# Altium project PDB_Custom_MCU.PrjPcb
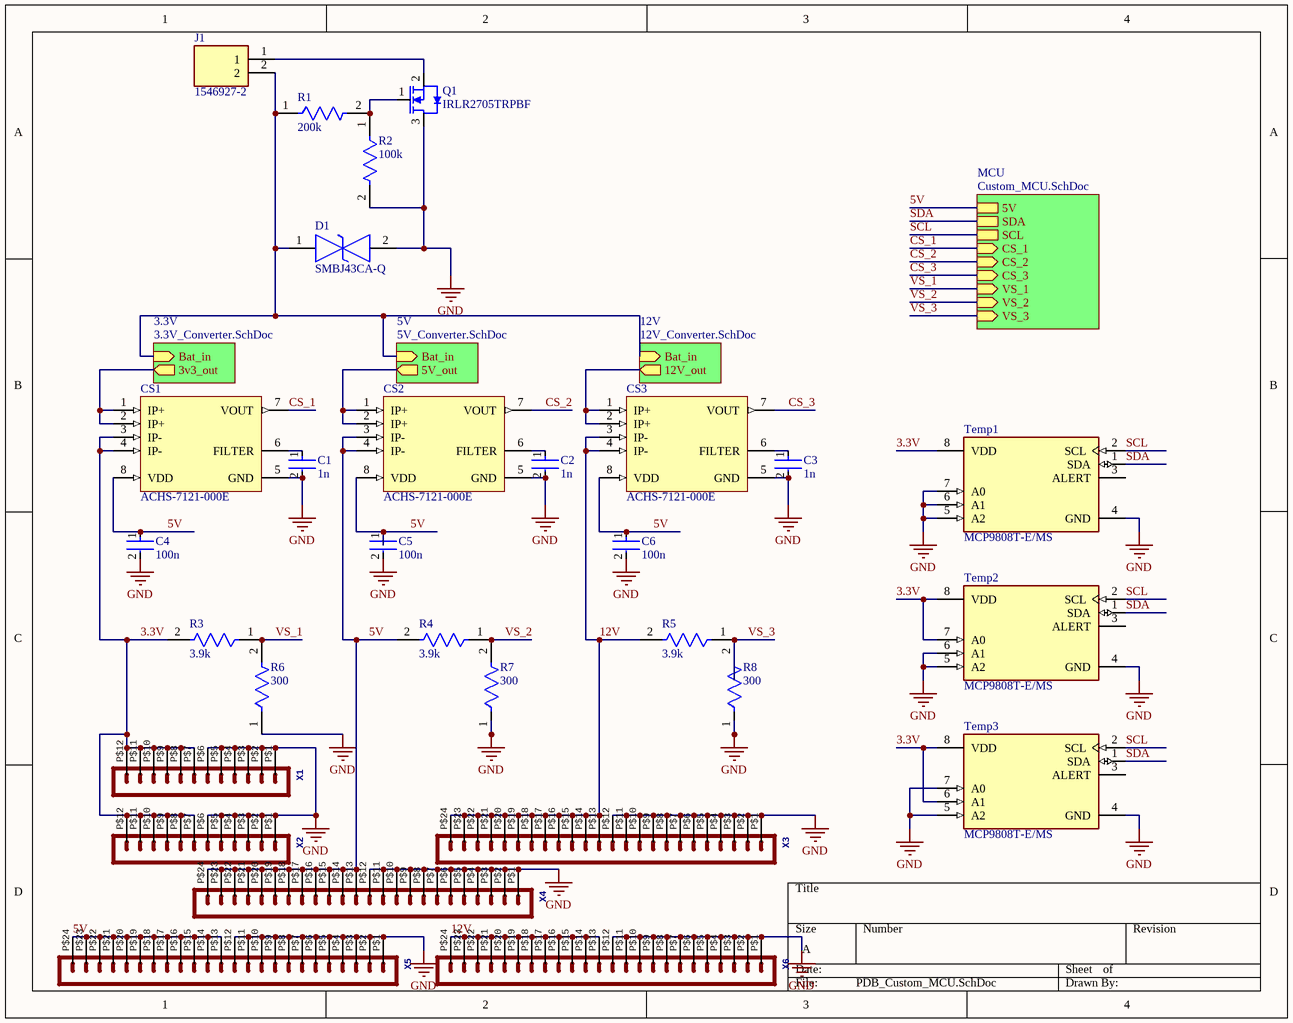
[diagram p0: PDB_Custom_MCU.SchDoc]
5 sheets, 83 parts. Net scope: hierarchical (ports join the sheet entries above them; power ports are global).
Board file: PDBMCU.PcbDoc
Sheets:
  PDB_Custom_MCU.SchDoc
    3.3V = 3.3V_Converter.SchDoc
    MCU = Custom_MCU.SchDoc
      Power = MCU_Power.SchDoc
      Connectors = MCU_Connectors.SchDoc

## Sheet PDB_Custom_MCU.SchDoc
size A; SheetNumber: 1; SheetTotal: 8

### Parts
C1  1n  [FP-0603-L_1_6_0_15-W_0_81-IPC_A]
C2  1n  [FP-0603-L_1_6_0_15-W_0_81-IPC_A]
C3  1n  [FP-0603-L_1_6_0_15-W_0_81-IPC_A]
C4  100n  [FP-CGA3E-0_3-0_1-IPC_A]
C5  100n  [FP-CGA3E-0_3-0_1-IPC_A]
C6  100n  [FP-CGA3E-0_3-0_1-IPC_A]
CS1  ACHS-7121-000E  [ACHS-7121-000E]
CS2  ACHS-7121-000E  [ACHS-7121-000E]
CS3  ACHS-7121-000E  [ACHS-7121-000E]
D1  SMBJ43CA-Q  [DIONM5436X244N]
J1  1546927-2  [SHDR2W119P0X826_1X2_1770X1549X1549P]
Q1  IRLR2705TRPBF  [IRLR2705TRPBF]
R1  200k  [FP-CRCW0603-e3-IPC_C]
R2  100k  [FP-RC0603-0_55-MFG]
R3  3.9k  [FP-CRCW0603-e3-IPC_A]
R4  3.9k  [FP-CRCW0603-e3-IPC_A]
R5  3.9k  [FP-CRCW0603-e3-IPC_A]
R6  300  [FP-CRCW0603-e3-IPC_A]
R7  300  [FP-CRCW0603-e3-IPC_A]
R8  300  [FP-CRCW0603-e3-IPC_A]
Temp1  MCP9808T-E/MS  [FP-C04-111-MFG]
Temp2  MCP9808T-E/MS  [FP-C04-111-MFG]
Temp3  MCP9808T-E/MS  [FP-C04-111-MFG]
X1  Molex - Micro-Fit 3.0 Series connector,  3.00mm (0.118") pitch header, 12 positions.  [44914-1201]  (value not drawn)
X2  Molex - Micro-Fit 3.0 Series connector,  3.00mm (0.118") pitch header, 12 positions.  [44914-1201]  (value not drawn)
X3  Molex - Micro-Fit 3.0 Series connector,  3.00mm (0.118") pitch header, 24 positions.  [44914-2401]  (value not drawn)
X4  Molex - Micro-Fit 3.0 Series connector,  3.00mm (0.118") pitch header, 24 positions.  [44914-2401]  (value not drawn)
X5  Molex - Micro-Fit 3.0 Series connector,  3.00mm (0.118") pitch header, 24 positions.  [44914-2401]  (value not drawn)
X6  Molex - Micro-Fit 3.0 Series connector,  3.00mm (0.118") pitch header, 24 positions.  [44914-2401]  (value not drawn)

### Sub-sheets
3.3V = 3.3V_Converter.SchDoc: 3v3_out (out), Bat_in (in)
5V = 5V_Converter.SchDoc (file not in this document): Bat_in (in), 5V_out (out)
12V = 12V_Converter.SchDoc (file not in this document): 12V_out (out), Bat_in (in)
MCU = Custom_MCU.SchDoc: CS_2 (in), CS_3 (in), CS_1 (in), 5V, VS_3 (in), VS_2 (in), VS_1 (in), SDA, SCL

### Nets
GND: C1.2 C2.2 C3.2 C4.2 C5.2 C6.2 CS1.5(GND) CS2.5(GND) CS3.5(GND) D1.2 Q1.3 R2.2 R6.1 R7.1 R8.1 Temp1.4(GND) Temp1.5(A2) Temp1.6(A1) Temp1.7(A0) Temp2.4(GND) Temp2.5(A2) Temp2.6(A1) Temp3.4(GND) Temp3.5(A2) Temp3.7(A0) X1.P$1 X1.P$2 X1.P$3 X1.P$4 X1.P$5 X1.P$6 X2.P$1 X2.P$2 X2.P$3 X2.P$4 X2.P$5 X2.P$6 X3.P$1 X3.P$2 X3.P$3 X3.P$4 X3.P$5 X3.P$6 X3.P$7 X3.P$8 X3.P$9 X3.P$10 X3.P$11 X3.P$12 X4.P$1 X4.P$2 X4.P$3 X4.P$4 X4.P$5 X4.P$6 X4.P$7 X4.P$8 X4.P$9 X4.P$10 X4.P$11 X4.P$12 X5.P$1 X5.P$2 X5.P$3 X5.P$4 X5.P$5 X5.P$6 X5.P$7 X5.P$8 X5.P$9 X5.P$10 X5.P$11 X5.P$12 X6.P$1 X6.P$2 X6.P$3 X6.P$4 X6.P$5 X6.P$6 X6.P$7 X6.P$8 X6.P$9 X6.P$10 X6.P$11 X6.P$12
3.3V: CS1.3(IP-) CS1.4(IP-) R3.2 Temp1.8(VDD) Temp2.7(A0) Temp2.8(VDD) Temp3.6(A1) Temp3.8(VDD) X1.P$7 X1.P$8 X1.P$9 X1.P$10 X1.P$11 X1.P$12 X2.P$7 X2.P$8 X2.P$9 X2.P$10 X2.P$11 X2.P$12
5V: C4.1 C5.1 C6.1 CS1.8(VDD) CS2.3(IP-) CS2.4(IP-) CS2.8(VDD) CS3.8(VDD) R4.2 X4.P$13 X4.P$14 X4.P$15 X4.P$16 X4.P$17 X4.P$18 X4.P$19 X4.P$20 X4.P$21 X4.P$22 X4.P$23 X4.P$24 X5.P$13 X5.P$14 X5.P$15 X5.P$16 X5.P$17 X5.P$18 X5.P$19 X5.P$20 X5.P$21 X5.P$22 X5.P$23 X5.P$24 ; sheet MCU/5V
12V: CS3.3(IP-) CS3.4(IP-) R5.2 X3.P$13 X3.P$14 X3.P$15 X3.P$16 X3.P$17 X3.P$18 X3.P$19 X3.P$20 X3.P$21 X3.P$22 X3.P$23 X3.P$24 X6.P$13 X6.P$14 X6.P$15 X6.P$16 X6.P$17 X6.P$18 X6.P$19 X6.P$20 X6.P$21 X6.P$22 X6.P$23 X6.P$24
CS_1: CS1.7(VOUT) ; sheet MCU/CS_1
CS_2: CS2.7(VOUT) ; sheet MCU/CS_2
CS_3: CS3.7(VOUT) ; sheet MCU/CS_3
SCL: Temp1.2(SCL) Temp2.2(SCL) Temp3.2(SCL) ; sheet MCU/SCL
SDA: Temp1.1(SDA) Temp2.1(SDA) Temp3.1(SDA) ; sheet MCU/SDA
VS_1: R3.1 R6.2 ; sheet MCU/VS_1
VS_2: R4.1 R7.2 ; sheet MCU/VS_2
VS_3: R5.1 R8.2 ; sheet MCU/VS_3
NetC1_1: C1.1 CS1.6(FILTER)
NetC2_1: C2.1 CS2.6(FILTER)
NetC3_1: C3.1 CS3.6(FILTER)
NetCS1_1: CS1.1(IP+) CS1.2(IP+) ; sheet 3.3V/3v3_out
NetCS2_1: CS2.1(IP+) CS2.2(IP+) ; sheet 5V/5V_out
NetCS3_1: CS3.1(IP+) CS3.2(IP+) ; sheet 12V/12V_out
NetD1_1: D1.1 J1.2 R1.1 ; sheet 3.3V/Bat_in, sheet 5V/Bat_in, sheet 12V/Bat_in
NetJ1_1: J1.1 Q1.2
NetQ1_1: Q1.1 R1.2 R2.1

Not connected (* = marked no-connect by the designer): Temp1 3(ALERT); Temp2 3(ALERT); Temp3 3(ALERT)

### Library data of the parts
C1-C3 = CMP-2006-04378-2: General Purpose Ceramic Capacitor, 0603, 1nF, 10%, X7R, 15%, 50V; Case Code (Metric): 1608; Min Operating Temperature: -55°C; Weight: 7.1E-05oz; Series: -; Capacitance: 1nF; RoHS Compliant: Yes; Radiation Hardening: No; Height: 0.9mm; Mount: Surface Mount; REACH SVHC: No SVHC; Lead Free: Lead Free; Depth: 0.81mm; Voltage: 50V; Number of Pins: 2; Voltage Rating: 50V; Max Operating Temperature: 125°C; Termination: SMD/SMT; Construction: Flat; Case Code (Imperial): 0603; Dielectric: X7R; Width: 0.032inch; Tolerance: 10%; Case/Package: 0603; Contact Plating: Tin; Packaging: Tape and Reel; Voltage Rating (DC): 50V; Dielectric Material: Ceramic; Package Quantity: 4000; Thickness: 0.035inch; Length: 1.6mm
C4-C6 = CMP-2000-07546-2: Cap Ceramic 100nF 50V X7R 10% Pad SMD 0603 +125°C Automotive T/R; Weight: 7.1E-05oz; Composition: Ceramic; Max Operating Temperature: 125°C; Termination: SMD/SMT; Dielectric: X7R; Length: 1.6mm; Package Quantity: 1; REACH SVHC: No SVHC; Lead Free: Lead Free; Case Code (Metric): 1608; Min Operating Temperature: -55°C; Packaging: Tape and Reel; Tolerance: 10%; Voltage Rating: 50V; Case Code (Imperial): 0603; Capacitance: 100nF; Case/Package: 0603; Voltage Rating (DC): 50V; Depth: 0.8mm; Radiation Hardening: No; Ratings: AEC-Q200; Mount: Surface Mount; Voltage: 50V; Thickness: 0.035inch; Width: 0.8mm; Height: 0.8mm
D1 = SMBJ43CA-Q: TVS Diode (Bi-directional); Manufacturer_Name: Bourns; Assembled: yes; Datasheet Link: https://www.bourns.com/docs/Product-Datasheets/SMBJ-Q.pdf; Height: 2.44mm; Manufacturer_Part_Number: SMBJ43CA-Q; Mouser Part Number: 652-SMBJ43CA-Q; Mouser Price/Stock: https://www.mouser.co.uk/ProductDetail/Bourns/SMBJ43CA-Q?qs=f9yNj16SXrKKVbIQ83PDKg%3D%3D; Arrow Part Number: SMBJ43CA-Q; Arrow Price/Stock: https://www.arrow.com/en/products/smbj43ca-q/bourns?region=nac; Distributor: JLCPCB; JLCPCB Part Number: C224021
J1 = 1546927-2: Connector; Manufacturer_Name: TE Connectivity; Datasheet Link: https://www.te.com/commerce/DocumentDelivery/DDEController?Action=showdoc&DocId=Customer+Drawing%7F1546927%7FA3%7Fpdf%7FEnglish%7FENG_CD_1546927_A3.pdf%7F1546927-2; Height: 15.494mm; Manufacturer_Part_Number: 1546927-2; Mouser Part Number: 571-1546927-2; Mouser Price/Stock: https://www.mouser.co.uk/ProductDetail/TE-Connectivity/1546927-2?qs=30v%252BXxGwGAoQPG4oeAAMCA%3D%3D; Arrow Part Number: 1546927-2; Arrow Price/Stock: https://www.arrow.com/en/products/1546927-2/te-connectivity
R1 = CMP-2000-03059-2: RES Thick Film, 200kΩ, 1%, 0.1W, 100ppm/°C, 0603; Resistance: 200kR; Voltage Rating (DC): 75V; Power Rating: 100mW; Termination: SMD/SMT; Depth: 0.85mm; Military Standard: Not; Case Code (Metric): 1608; Composition: Thick Film; Package Quantity: 10; Width: 0.033inch; Voltage Rating: 75V; Features: Automotive AEC-Q200; Max Power Dissipation: 100mW; Height: 0.45mm; Mount: Surface Mount; Max Operating Temperature: 155°C; Weight: 7.1E-05oz; Lead Free: Lead Free; Length: 1.55mm; Radiation Hardening: No; Case/Package: 0603; Packaging: Tape and Reel; Contact Plating: Tin; Min Operating Temperature: -55°C; Working Voltage: 75V; Temperature Coefficient: 100ppm/°C; Case Code (Imperial): 0603; Tolerance: 1%; Number of Terminations: 2
R2 = CMP-2100-03662-2: RES SMD 100K OHM 1% 1/10W 0603; Voltage Rating (DC): 50V; Resistance: 100kR; Max Power Dissipation: 100mW; Temperature Coefficient: 100ppm/°C; Working Voltage: 75V; Length: 1.6mm; Lead Free: Lead Free; Number of Terminations: 2; Packaging: Tape and Reel; Voltage Rating: 50V; Termination: SMD/SMT; Width: 0.8mm; Resistor Type: Thick Film; Resistance Tolerance: 1%; Features: Moisture Resistant; Height: 0.45mm; Construction: Rectangular; Case/Package: 0603; Military Standard: Not; Case Code (Imperial): 0603; Series: RC; Technology: THICK FILM; Depth: 0.8mm; RoHS Compliant: Yes; REACH SVHC: No SVHC; Min Operating Temperature: -55°C; Case Code (Metric): 1608; Max Operating Temperature: 155°C; Power Rating: 100mW; Number of Pins: 2; Tolerance: 1%
R3-R5 = CMP-02407-001779-1: RES Thick Film, 3.9kΩ, 1%, 0.1W, 100ppm/°C, 0603; Voltage Rating: 75V; Power Rating: 100mW; Resistance: 3.9kR; Case Code (Imperial): 0603; Military Standard: Not; Length: 1.55mm; Lead Free: Lead Free; Max Operating Temperature: 155°C; Working Voltage: 75V; Termination: SMD/SMT; Min Operating Temperature: -55°C; Contact Plating: Tin; Depth: 0.85mm; Packaging: Tape and Reel; Voltage Rating (DC): 75V; Tolerance: 1%; Features: Automotive AEC-Q200; Package Quantity: 10; Composition: Thick Film; Mount: Surface Mount; Width: 0.033inch; Radiation Hardening: No; Max Power Dissipation: 100mW; Height: 0.45mm; Temperature Coefficient: 100ppm/°C; Weight: 7.1E-05oz; Case Code (Metric): 1608; Case/Package: 0603; Number of Terminations: 2
R6-R8 = CMP-2000-03216-2: RES Thick Film, 300Ω, 1%, 0.1W, 100ppm/°C, 0603; Voltage Rating (DC): 75V; Power Rating: 100mW; Resistance: 300R; Length: 1.55mm; Height: 0.45mm; Case/Package: 0603; Temperature Coefficient: 100ppm/°C; Packaging: Tape and Reel; Termination: SMD/SMT; Depth: 0.85mm; Max Operating Temperature: 155°C; Radiation Hardening: No; Tolerance: 1%; Lead Free: Lead Free; Case Code (Metric): 1608; Voltage Rating: 75V; Weight: 7.1E-05oz; Package Quantity: 10; Military Standard: Not; Case Code (Imperial): 0603; Composition: Thick Film; Min Operating Temperature: -55°C; Width: 0.033inch; Number of Terminations: 2; Mount: Surface Mount; Features: Automotive AEC-Q200; Contact Plating: Tin; Max Power Dissipation: 100mW
Temp1-Temp3 = CMP-0192-00343-2: SENSOR DIGITAL -40C-125C 8MSOP; Interface: I2C; Operating Supply Current: 200uA; Resolution: 10b; Min Supply Voltage: 2.7V; Max Supply Voltage (DC): 5.5V; Width: 3mm; Height: 0.95mm; Package Quantity: 2500; Length: 3mm; Lead Free: Lead Free; Radiation Hardening: No; Number of Pins: 8; Min Supply Voltage (DC): 2.7V; Output Type: Digital; Packaging: Tape and Reel; Max Supply Voltage: 5.5V; Max Operating Temperature: 125°C; Case/Package: MSOP; Min Operating Temperature: -40°C
X1 X2 = HEADER_POS12_?44914-1201: GateName_1: G$1; SymbolName_1: HEADER_POS12; DeviceName: 44914-1201; LibraryName: con-molex-micro-fit-3_0_2; DeviceSetName: HEADER_POS12_?; Package: 44914-1201
X3-X6 = HEADER_POS24_?44914-2401: GateName_1: G$1; SymbolName_1: HEADER_POS24; DeviceName: 44914-2401; LibraryName: con-molex-micro-fit-3_0_2; DeviceSetName: HEADER_POS24_?; Package: 44914-2401

## Sheet 3.3V_Converter.SchDoc
size A; SheetNumber: 2; SheetTotal: 8
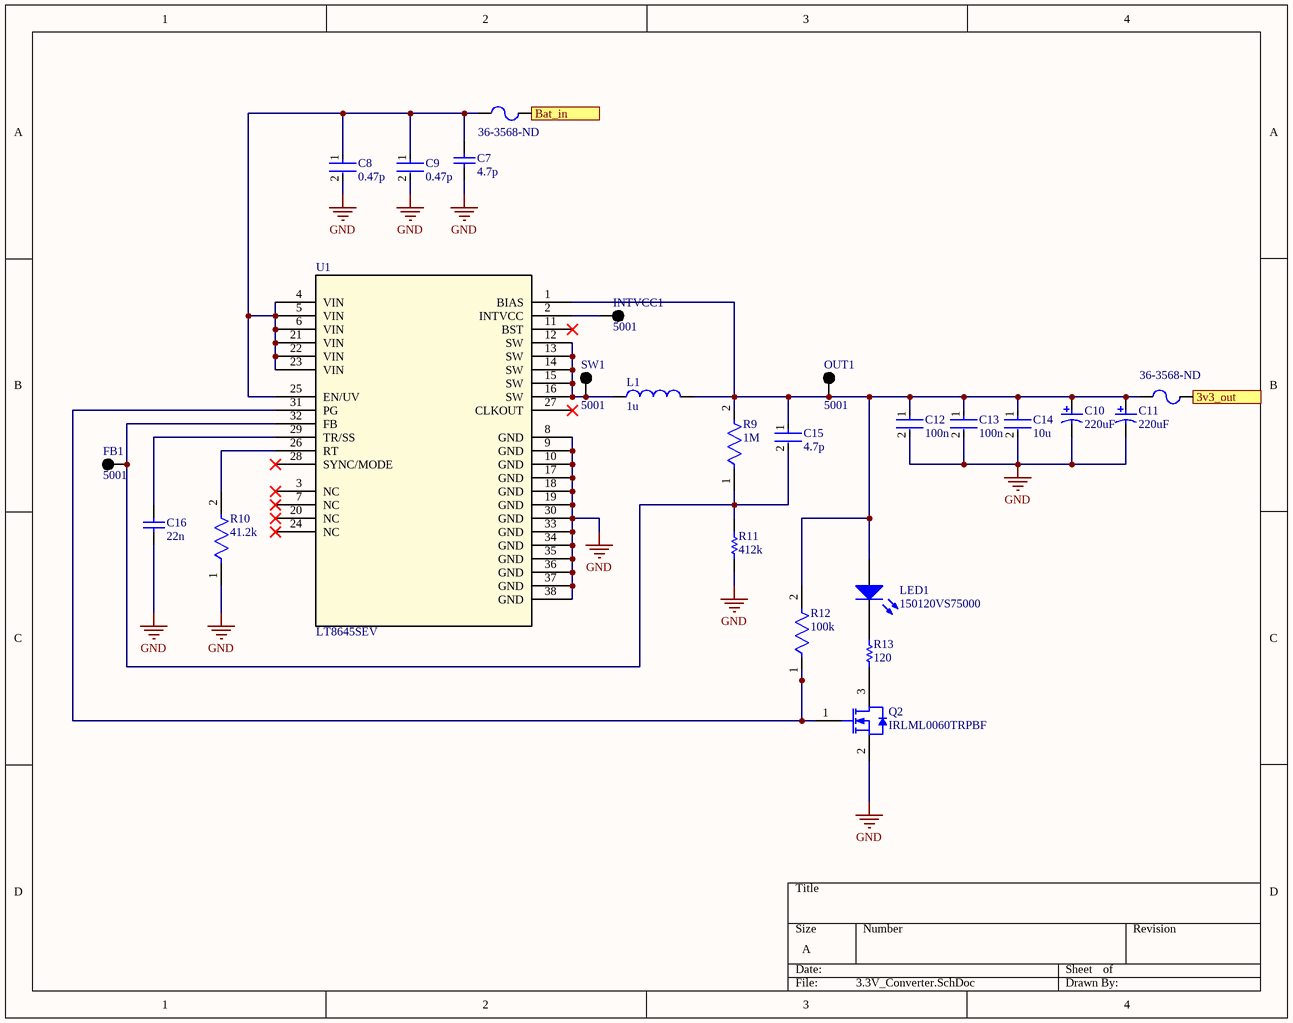
[diagram p1: 3.3V_Converter.SchDoc]

### Parts
C7  4.7p  [CAPC1608X90X35ML10T15]
C8  0.47p  [FP-CL21-IPC_B]
C9  0.47p  [FP-CL21-IPC_B]
C10  220uF  [CAPPR65-500-1250X1000X1350]
C11  220uF  [CAPPR65-500-1250X1000X1350]
C12  100n  [FP-CL10-IPC_A]
C13  100n  [FP-CL10-IPC_A]
C14  10u  [FP-GRM21B-0_15-IPC_C]
C15  4.7p  [FP-0603-L_1_6_0_15-W_0_81-MFG]
C16  22n  [CAPC1608X90X35ML10T15]
F1  36-3568-ND  [PCBComponent_1]
F2  36-3568-ND  [PCBComponent_1]
FB1  5001  [KSTN-5001]
INTVCC1  5001  [KSTN-5001]
L1  1u  [PCBComponent_1]
LED1  150120VS75000  [1206_A]
OUT1  5001  [KSTN-5001]
Q2  IRLML0060TRPBF  [INTR-SOT-23-3_V]
R9  1M  [FP-CRCW0603-e3-MFG]
R10  41.2k  [FP-CRCW0603-e3-MFG]
R11  412k  [RESC1608X55X30LL15T15]
R12  100k  [FP-RC0603-0_55-MFG]
R13  120  [RESC1609X55X30ML15T15]
SW1  5001  [KSTN-5001]
U1  LT8645SEV  [LQFN-32]

### Ports
3v3_out (out), Bat_in (in)

### Nets
GND: C7.1 C8.2 C9.2 C10.2 C11.2 C12.2 C13.2 C14.2 C16.1 Q2.2(S) R10.1 R11.1 U1.8(GND) U1.9(GND) U1.10(GND) U1.17(GND) U1.18(GND) U1.19(GND) U1.30(GND) U1.33(GND) U1.34(GND) U1.35(GND) U1.36(GND) U1.37(GND) U1.38(GND)
NetC7_2: C7.2 C8.1 C9.1 F1.1 U1.4(VIN) U1.5(VIN) U1.6(VIN) U1.21(VIN) U1.22(VIN) U1.23(VIN) U1.25(EN/UV)
NetC10_1: C10.1 C11.1 C12.1 C13.1 C14.1 C15.1 F2.1 L1.2 LED1.2(A) OUT1.1 R9.2 R12.2 U1.1(BIAS)
NetC15_2: C15.2 FB1.1 R9.1 R11.2 U1.32(FB)
NetC16_2: C16.2 U1.29(TR/SS)
NetCS1_1: F2.2 ; port 3v3_out
NetD1_1: F1.2 ; port Bat_in
NetINTVCC1_1: INTVCC1.1 U1.2(INTVCC)
NetL1_1: L1.1 SW1.1 U1.12(SW) U1.13(SW) U1.14(SW) U1.15(SW) U1.16(SW)
NetLED1_1: LED1.1(K) R13.2
NetQ2_1: Q2.1(G) R12.1 U1.31(PG)
NetQ2_3: Q2.3(D) R13.1
NetR10_2: R10.2 U1.26(RT)

Not connected (* = marked no-connect by the designer): U1 3(NC)* 7(NC)* 11(BST)* 20(NC)* 24(NC)* 27(CLKOUT)* 28(SYNC/MODE)*

### Library data of the parts
C7 = CMP-2006-02676-1: Part Number: GRM1885C1H4R7CA01D; Manufacturer: Murata
C8 C9 = CMP-13271-000950-1: CL21 Series 0805 0.47pF 50V ±0.1pF Tolerance C0G Multilayer Ceramic Chip Capacitor; Temperature Coefficient: 300ppm/°C; Length: 2mm; Case Code (Metric): 2012; Width: 0.049inch; Case Code (Imperial): 0805; Radiation Hardening: No; Voltage: 50V; Height: 0.65mm; Voltage Rating (DC): 50V; Package Quantity: 1; Capacitance: 0.47pF; Voltage Rating: 50V; Max Operating Temperature: 125°C; Min Operating Temperature: -55°C; Dielectric: C0G; Depth: 1.25mm; Thickness: 0.03inch; Lead Free: Lead Free; Packaging: Tape and Reel; Case/Package: 0805; Mount: Surface Mount
C10 C11 = CMP-1665-00043-1: Aluminum Electrolytic Capacitor, 220 uF, +/- 20%, 50 V, -40 to 85 degC, 2-Pin THD, RoHS, Bulk; Max Supply Voltage: 5.5 V; Min Supply Voltage: 4.5 V; Propagation Delay: 10 us; Data Rate: 120 kbps; Nominal Supply Current: 10 mA; Case\Package: SOIC; Nominal Supply Voltage: 5 V; Channels: 2; Interface: RS-232; Width: 4 mm; Packaging: Rail/Tube; ComponentLink2Description: Datasheet; Height: 1.5 mm; PackageReference: CAPPR65-500-1250X1000X1350; Pins: 16; DatasheetVersion: Mar-16; Max Operating Temperature: 70 degC; Length: 10 mm; REACH SVHC: No SVHC; ComponentLink1Description: Manufacturer URL; Package Quantity: 50; ComponentLink2URL: http://industrial.panasonic.com/cdbs/www-data/pdf/RDF0000/DMF0000COL68.pdf; ComponentLink1URL: http://www.panasonic.com/; PackageDescription: 2-Pin Radial Lead, Dia 10 mm, Body Length 12.5 mm; Min Operating Temperature: 0 degC; Radiation Hardening: No; RoHSCompliant: true; Mount: Surface Mount
C12 C13 = CMP-13271-000587-1: Cap Ceramic 100nF 50V X7R ±10% Pad SMD 0603 +125°C T/R; Case/Package: 0603; Depth: 0.8mm; Max Operating Temperature: 125°C; Lead Free: Lead Free; Material: Ceramic; Voltage Rating: 50V; Min Operating Temperature: -55°C; Voltage Rating (DC): 50V; Dielectric: X7R; Height: 0.8mm; Capacitance: 100nF; Thickness: 0.035inch; Radiation Hardening: No; Voltage: 50V; Packaging: Tape and Reel; Length: 1.6mm; Tolerance: 10%; Width: 0.031inch; Mount: Surface Mount; Package Quantity: 10000
C14 = CMP-2007-03541-2: Chip Multilayer Ceramic Capacitors for General Purpose, 0805, 10uF, X5R, 15%, 10%, 25V; Length: 2mm; Depth: 1.25mm; Termination: SMD/SMT; Voltage: 25V; Height: 1.25mm; Material: Ceramic; Thickness: 0.053inch; Radiation Hardening: No; Min Operating Temperature: -55°C; Width: 0.049inch; Package Quantity: 1; Mount: Surface Mount; Dielectric: X5R; Packaging: Tape and Reel; Capacitance: 10uF; Voltage Rating (DC): 25V; Lead Free: Lead Free; Max Operating Temperature: 85°C; Case Code (Imperial): 0805; Case/Package: 0805; Tolerance: 10%; Voltage Rating: 25V; Case Code (Metric): 2012
C15 = CMP-2006-04327-2: General Purpose Ceramic Capacitor, 0603, 4.7pF, 0.25pF, NP0, 30ppm/°C, 50V; Insulation Resistance: 100GR; Dielectric: C0G; Case/Package: 0603; RoHS Compliant: Yes; Case Code (Imperial): 0603; Contact Plating: Tin; REACH SVHC: No SVHC; Construction: Flat; Voltage Rating: 50V; Case Code (Metric): 1608; Min Operating Temperature: -55°C; Termination: SMD/SMT; Max Operating Temperature: 125°C; Capacitance: 4.7pF; Depth: 0.81mm; Radiation Hardening: No; Lead Free: Lead Free; Mount: Surface Mount; Thickness: 0.035inch; Width: 0.81mm; Series: -; Package Quantity: 4000; Packaging: Tape and Reel; Number of Pins: 2; Temperature Coefficient: 30ppm/°C; Voltage Rating (DC): 50V; Height: 0.86mm; Length: 1.6mm
C16 = CMP-2006-02910-1: Manufacturer: Murata; Part Number: GRM188R71H223KA01D
F1 F2 = Fuse_Holder
FB1 = CMP-2000-05181-1: Test Point, Black, 1-Pin THD, RoHS, Bulk; Manufacturer: Keystone; Other Names: 5001K; Catalog Drawings: 5000Series; Alternate Color: 5004K-ND / -TESTPOINTPCMINI.040"DYELLOW / 5003K-ND / -TESTPOINTPCMINI.040"DORANGE / 5002K-ND / -TESTPOINTPCMINI.040"DWHITE / 5000K-ND / -TESTPOINTPCMINI.040"DRED; Kits: DKTGRS232C-KIT-ND / -TTLCONVERTER; Material: Base,Nylon46,UL94V-0; Type: PCTestPoint,Miniature; Online Catalog: ColorCodedTestPoints; Datasheet URL: https://ciiva.com/datasheet-click-2917627?src=ciiva&sig=bd195616; Mounting Type: 0.040"(1.02mm)HoleDiameter; Family: TestPoints; RoHS Information: RoHSComplianceStatement; Datasheet Version: Rev. G, 12/2008; Color: Black; Category: TestandMeasurement; Standard Package: 100; Manufacturer URL: http://www.keyelco.com/; Terminal: 0.010"x0.020"(0.25mmx0.51mm)PhosphorBronzeWire,SilverPlated; Series: THM; Packaging: Bulk
INTVCC1 OUT1 SW1 = CMP-2000-05181-1: Test Point, Black, 1-Pin THD, RoHS, Bulk; Manufacturer: Keystone; Other Names: 5001K; Catalog Drawings: 5000Series; Alternate Color: 5004K-ND / -TESTPOINTPCMINI.040"DYELLOW / 5003K-ND / -TESTPOINTPCMINI.040"DORANGE / 5002K-ND / -TESTPOINTPCMINI.040"DWHITE / 5000K-ND / -TESTPOINTPCMINI.040"DRED; Kits: DKTGRS232C-KIT-ND / -TTLCONVERTER; Online Catalog: ColorCodedTestPoints; Datasheet URL: https://ciiva.com/datasheet-click-2917627?src=ciiva&sig=bd195616; Mounting Type: 0.040"(1.02mm)HoleDiameter; Family: TestPoints; RoHS Information: RoHSComplianceStatement; Datasheet Version: Rev. G, 12/2008; Color: Black; Category: TestandMeasurement; Standard Package: 100; Manufacturer URL: http://www.keyelco.com/; Material: Base,Nylon46,UL94V-0; Type: PCTestPoint,Miniature; Terminal: 0.010"x0.020"(0.25mmx0.51mm)PhosphorBronzeWire,SilverPlated; Series: THM; Packaging: Bulk
L1 = XAL6030-102MEC
LED1 = CMP-1426-00016-1: SMD mono-color Chip LED, WL-SMCW, Bright Green; Manufacturer: Wuerth Elektronik; ComponentLink2URL: http://katalog.we-online.com/led/datasheet/150120VS75000.pdf; PartNumber: 150120VS75000; Color: Bright Green; ComponentLink2Description: Datasheet; ComponentLink1URL: http://www.we-online.com; PackageReference: 1206_A; ComponentLink1Description: Manufacturer URL
Q2 = CMP-2000-06485-1: HEXFET Power MOSFET / , 60 V, 2.7 A, -55 to 150 degC, 3-Pin SOT-23, RoHS, Tape and Reel; Manufacturer: International Rectifier; Maximum Gate Source Voltage: ±16V; Typical Turn On Delay Time: 5.4ns; Number of Elements per Chip: 1; Maximum Power Dissipation: 1.25W; Maximum Continuous Drain Current: 2.7A; Typical Gate Charge @ Vgs: 2.5nC@4.5V; Configuration: Single; Channel Type: N; Forward Transconductance: 7.6S; Channel Mode: Enhancement; Typical Input Capacitance @ Vds: 290pF@25V; Typical TurnOff Delay Time: 6.8ns; Maximum Drain Source Voltage: 60V; Maximum Drain Source Resistance: 92mΩ; Forward Diode Voltage: 1.3V; Length: 3.04mm; Width: 1.4mm; Series: HEXFET®Series; Category: PowerMOSFET; Datasheet Version: 03/2012; Operating Temperature Range: -55to+150°C; Height: 1.02mm; Package Type: Micro8; Mounting Technology: SurfaceMount; Package Reference: SOT-23-3; Datasheet URL: http://www.infineon.com/dgdl/irlml0060pbf.pdf?fileId=5546d462533600a40153566493ef25e6; Mounting Type: SurfaceMount; Maximum Operating Temperature: +150°C; Dimensions: 3.04x1.40x1.02mm; Minimum Operating Temperature: -55°C; Manufacturer URL: http://internationalrectifier.com/; Pin Count: 3; Package Description: 3-Pin Small Outline Transistor, Body 2.92 x 1.3 mm, Pitch 0.95 mm
R9 = CMP-2000-03013-2: RES Thick Film, 1MΩ, 1%, 0.1W, 100ppm/°C, 0603; Max Power Dissipation: 100mW; Resistance: 1MR; Voltage Rating (DC): 75V; Depth: 0.85mm; Max Operating Temperature: 155°C; Length: 1.55mm; Power Rating: 100mW; Military Standard: Not; Features: Automotive AEC-Q200; Min Operating Temperature: -55°C; Number of Pins: 2; Mount: Surface Mount; Package Quantity: 10; Packaging: Tape and Reel; Height: 0.45mm; Radiation Hardening: No; Case Code (Metric): 1608; Temperature Coefficient: 100ppm/°C; Width: 0.85mm; Composition: Thick Film; Termination: SMD/SMT; Tolerance: 1%; Number of Terminations: 2; Lead Free: Lead Free; Contact Plating: Tin; Case/Package: 0603; Weight: 7.1E-05oz; Voltage Rating: 75V; Case Code (Imperial): 0603
R10 = CMP-1012-00692-3: RES Thick Film, 41.2kΩ, 1%, 0.1W, 100ppm/°C, 0603; Voltage Rating: 75V; Max Power Dissipation: 100mW; Resistance: 41.2kR; Military Standard: Not; Radiation Hardening: No; Packaging: Tape and Reel; Max Operating Temperature: 155°C; Case Code (Metric): 1608; Contact Plating: Tin; Case Code (Imperial): 0603; Package Quantity: 10; Features: Automotive AEC-Q200; Min Operating Temperature: -55°C; Voltage Rating (DC): 75V; Tolerance: 1%; Termination: SMD/SMT; Mount: Surface Mount; Temperature Coefficient: 100ppm/°C; Number of Terminations: 2; Depth: 0.85mm; Height: 0.45mm; Length: 1.55mm; Width: 0.033inch; Weight: 7.1E-05oz; Composition: Thick Film; Power Rating: 100mW; Case/Package: 0603; Lead Free: Lead Free
R11 = CMP-2000-00492-1: Manufacturer: Panasonic; Part Number: ERJ-3EKF4123V
R12 = CMP-2100-03662-2: as R2 on sheet PDB_Custom_MCU; Length: 1.6mm; Lead Free: Lead Free; Number of Terminations: 2; Packaging: Tape and Reel; Voltage Rating: 50V; Termination: SMD/SMT; Width: 0.8mm; Resistor Type: Thick Film; Resistance Tolerance: 1%; Features: Moisture Resistant; Height: 0.45mm; Construction: Rectangular; Case/Package: 0603; Military Standard: Not; Case Code (Imperial): 0603; Series: RC; Technology: THICK FILM; Depth: 0.8mm; RoHS Compliant: Yes; REACH SVHC: No SVHC; Min Operating Temperature: -55°C; Case Code (Metric): 1608; Max Operating Temperature: 155°C; Power Rating: 100mW; Number of Pins: 2; Tolerance: 1%
R13 = CMP-2000-00213-2: Chip Resistor, 120 Ohm, +/- 1%, 0.1 W, -55 to 155 degC, 0603 (1608 Metric), RoHS, Tape and Reel; Manufacturer: Panasonic; Power Rating: 100mW; Voltage Rating (DC): 75V; Resistance: 120Ohm; Temperature Coefficient: 100ppm/degreesC; Number of Terminations: 2; Military Standard: Not; Tolerance: 1%; Min Operating Temperature: -55degC; Packaging: TapeandReel; Lead Free: LeadFree; Max Operating Temperature: 155degC; Manufacturer URL: http://www.panasonic.com/; Case Code (Imperial): 0603; REACH SVHC: NoSVHC; Width: 0.031inch; Datasheet URL: https://industrial.panasonic.com/cdbs/www-data/pdf/RDA0000/AOA0000C283.pdf; RoHSCompliant: true; Max Power Dissipation: 100mW; Termination: SMD/SMT; Package Reference: 0603; Height: 0.022inch; Depth: 0.8mm; Package Description: 2-Pin Surface Mount Device, Body 1.6 x 0.85 mm; Contact Plating: Tin; Length: 1.6mm; Package URL: http://www.st.com/st-web-ui/static/active/en/resource/technical/document/datasheet/CD00001320.pdf; Radiation Hardening: No; Package Quantity: 1; Number of Pins: 2; Datasheet Version: 42095.0; Voltage Rating: 75V; Composition: ThickFilm; Case/Package: 0603; Mount: SurfaceMount; Case Code (Metric): 1608
U1 = LT8645SEV: No Description Available; Copyright: Copyright (C) 2018 Accelerated Designs. All rights reserved; RefDes: RefDes; Type: DEV; Value: Value

## Sheet Custom_MCU.SchDoc
size A; SheetNumber: 5; SheetTotal: 8
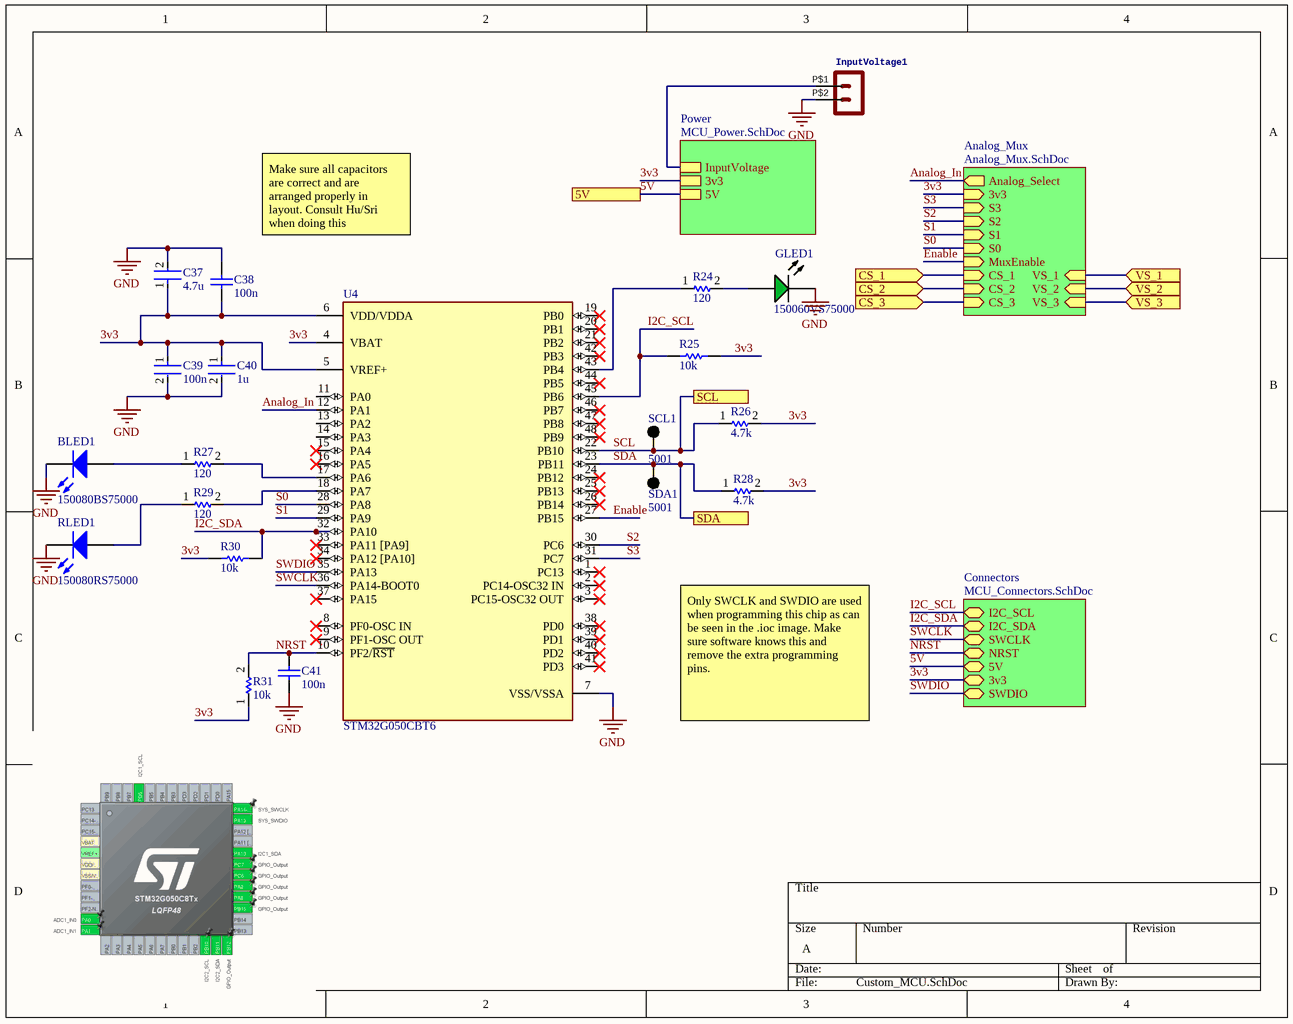
[diagram p2: Custom_MCU.SchDoc]

### Parts
BLED1  150080BS75000  [0805_A]
C37  4.7u  [FP-CL282-IPC_C]
C38  100n  [CAPC1050X55X23ML05T13]
C39  100n  [FP-CL10-0_1-MFG]
C40  1u  [FP-CL542-IPC_C]
C41  100n  [CAPC1050X55X23ML05T13]
GLED1  150060VS75000  [WE-150060VS75000_V]
InputVoltage1  Molex - Micro-Fit 3.0 Series connector,  3.00mm (0.118") pitch header, 2 positions.  [44914-0201]  (value not drawn)
R24  120  [0402WGF1200TCE]
R25  10k  [RESC1609X55X30LL15T15]
R26  4.7k  [0402WGF4701TCE]
R27  120  [0402WGF1200TCE]
R28  4.7k  [0402WGF4701TCE]
R29  120  [0402WGF1200TCE]
R30  10k  [RESC1609X55X30LL15T15]
R31  10k  [0402WGF1002TCE]
RLED1  150080RS75000  [0805_A]
SCL1  5001  [KSTN-5001]
SDA1  5001  [KSTN-5001]
U4  STM32G050CBT6  [FP-LQFP48-5B-MFG]

### Sub-sheets
Analog_Mux = Analog_Mux.SchDoc (file not in this document): CS_3 (in), Analog_Select (out), S0 (in), S2 (in), S1 (in), CS_1 (in), CS_2 (in), MuxEnable (in), S3 (in), VS_2 (in), VS_1 (in), VS_3 (in), 3v3 (in)
Connectors = MCU_Connectors.SchDoc: SWCLK (bidir), NRST (bidir), 5V (bidir), SWDIO (bidir), 3v3 (bidir), I2C_SCL (bidir), I2C_SDA (bidir)
Power = MCU_Power.SchDoc: InputVoltage, 5V, 3v3

### Ports
5V, CS_1 (in), CS_2 (in), CS_3 (in), SCL, SDA, VS_1 (in), VS_2 (in), VS_3 (in)

### Nets
3v3: C37.1 C38.2 C39.1 C40.1 R25.1 R26.2 R28.2 R30.1 R31.1 U4.4(VBAT) U4.5(VREF+) U4.6(VDD/VDDA) ; sheet Analog_Mux/3v3, sheet Power/3v3, sheet Connectors/3v3
GND: BLED1.1(K) C37.2 C38.1 C39.2 C40.2 C41.1 GLED1.1(K) InputVoltage1.P$2 RLED1.1(K) U4.7(VSS/VSSA)
5V: port 5V, sheet Power/5V, sheet Connectors/5V
Analog_In: U4.12(PA1) ; sheet Analog_Mux/Analog_Select
CS_1: port CS_1, sheet Analog_Mux/CS_1
CS_2: port CS_2, sheet Analog_Mux/CS_2
CS_3: port CS_3, sheet Analog_Mux/CS_3
Enable: U4.27(PB15) ; sheet Analog_Mux/MuxEnable
I2C_SCL: R25.2 U4.45(PB6) ; sheet Connectors/I2C_SCL
I2C_SDA: R30.2 U4.32(PA10) ; sheet Connectors/I2C_SDA
NRST: C41.2 R31.2 U4.10(PF2/~{RST}) ; sheet Connectors/NRST
S0: U4.28(PA8) ; sheet Analog_Mux/S0
S1: U4.29(PA9) ; sheet Analog_Mux/S1
S2: U4.30(PC6) ; sheet Analog_Mux/S2
S3: U4.31(PC7) ; sheet Analog_Mux/S3
SCL: R26.1 SCL1.1 U4.22(PB10) ; port SCL
SDA: R28.1 SDA1.1 U4.23(PB11) ; port SDA
SWCLK: U4.36(PA14-BOOT0) ; sheet Connectors/SWCLK
SWDIO: U4.35(PA13) ; sheet Connectors/SWDIO
VS_1: port VS_1, sheet Analog_Mux/VS_1
VS_2: port VS_2, sheet Analog_Mux/VS_2
VS_3: port VS_3, sheet Analog_Mux/VS_3
NetBLED1_2: BLED1.2(A) R27.1
NetD3_1: InputVoltage1.P$1 ; sheet Power/InputVoltage
NetGLED1_2: GLED1.2(A) R24.2
NetR24_1: R24.1 U4.43(PB4)
NetR27_2: R27.2 U4.17(PA6)
NetR29_1: R29.1 RLED1.2(A)
NetR29_2: R29.2 U4.18(PA7)

Not connected (* = marked no-connect by the designer): U4 1(PC13)* 2(PC14-OSC32_IN)* 3(PC15-OSC32_OUT)* 8(PF0-OSC_IN)* 9(PF1-OSC_OUT)* 11(PA0) 13(PA2) 14(PA3) 15(PA4)* 16(PA5)* 19(PB0)* 20(PB1)* 21(PB2)* 24(PB12)* 25(PB13)* 26(PB14)* 33(PA11_[PA9])* 34(PA12_[PA10])* 37(PA15)* 38(PD0)* 39(PD1)* 40(PD2)* 41(PD3)* 42(PB3)* 44(PB5)* 46(PB7)* 47(PB8)* 48(PB9)*

### Notes on the sheet
- Make sure all capacitors are correct and are arranged properly in layout. Consult Hu/Sri when doing this
- Only SWCLK and SWDIO are used when programming this chip as can be seen in the .ioc image. Make sure software knows this and remove the extra programming pins.

### Library data of the parts
BLED1 = CMP-1426-00008-1: SMD mono-color Chip LED, WL-SMCW, Blue; Manufacturer: Wuerth Elektronik; Color: Blue; ComponentLink2URL: http://katalog.we-online.com/led/datasheet/150080BS75000.pdf; ComponentLink1URL: http://www.we-online.com; ComponentLink2Description: Datasheet; PackageReference: 0805_A; ComponentLink1Description: Manufacturer URL; PartNumber: 150080BS75000
C37 = CMP-13271-000548-1: Cap Ceramic 4.7uF 10V X5R ±20% SMD 0402 +85°C Paper T/R; Assembled: yes; Capacitance: 4.7uF; Max Operating Temperature: 85°C; Lead Free: Lead Free; Tolerance: 20%; Voltage Rating: 10V; Dielectric: X5R; Width: 0.02inch; Length: 0.039inch; Case/Package: 0402; Min Operating Temperature: -55°C; Packaging: Tape and Reel; Thickness: 0.022inch; Case Code (Imperial): 0402; Package Quantity: 10000; Case Code (Metric): 1005; Mount: Surface Mount; Distributor: JLCPCB; JLCPCB Part Number: C23733
C38 C41 = CMP-2000-05439-1: Chip Capacitor, 100 nF, +/- 10%, 16 V, -55 to 125 degC, 0402 (1005 Metric), RoHS, Tape and Reel; Manufacturer: Samsung Electro-Mechanics; Capacitance: 100000pF; Dielectric: X7R; Rated Voltage: 16V; Assembled: yes; Case Size/Dimension: 0402; Tolerance (%): ±10%; Manufacturer URL: http://www.samsungsem.com/global/index.jsp; Datasheet URL: https://datasheet.ciiva.com/29198/458718-da-01-en-vs-kondensator-0402-29198423.pdf; Datasheet Version: Nov-10; Distributor: JLCPCB; JLCPCB Part Number: C1525
C39 = CMP-13271-000011-1: CAP CER 0.1UF 50V X7R 0603; Manufacturer: Samsung Electro-Mechanics America, Inc; Manufacturer Part Number: CL10B104JB8NNNC; Value: 100nF; Material: Ceramic; Temperature Coefficient: 15%; Tolerance: 5%; Ipc Land Pattern Name: CAPC16080X80; Device Class L1: Passive Components; Digikey Description: CAP CER 0.1UF 50V X7R 0603; Voltage Rating: 50V; Height: 0.9mm; ComponentLink2Description: Datasheet; Device Class L2: Capacitors; ComponentLink2URL: http://www.samsungsem.com/kr/support/product-search/mlcc/__icsFiles/afieldfile/2019/06/18/CL10B104JB8NNNC-19.pdf; Temperature Characteristic: X7R; Temperature Range High: +125°C; Lead Free: Yes; Temperature Range Low: -55°C; Category: Cap; Package: CL10-0.1; Temperature: -55°C to +125°C; Octopart: https://octopart.com/cl10b104jb8nnnc-samsung-9302151; Device Class L3: Ceramic Capacitors; RoHS: TRUE; Automotive: No; Capacitance: 100nF
C40 = CMP-13271-001051-1: Cap Ceramic 1uF 25V X5R ±10% SMD 0402 +85°C Paper T/R; Assembled: yes; Radiation Hardening: No; Lead Free: Lead Free; Capacitance: 1uF; Package Quantity: 10000; Max Operating Temperature: 85°C; Voltage Rating: 25V; Case/Package: 0402; Min Operating Temperature: -55°C; Packaging: Tape and Reel; Tolerance: 10%; Height: 0.5mm; Thickness: 0.022inch; Case Code (Metric): 1005; Width: 0.02inch; Case Code (Imperial): 0402; Dielectric: X5R; Length: 1mm; Mount: Surface Mount; Material: Ceramic; Depth: 0.5mm; Distributor: JLCPCB; JLCPCB Part Number: C52923
GLED1 = CMP-1426-00006-4: WL-SMCW SMD Chip LED Top View Monocolor Waterclear, 30 mA, 2 V, -40 to 85 degC, 2-Pin SMD, RoHS, Tape and Reel; DatasheetVersion: Rev. 2.7; PackageDescription: 2-Pin Surface Mount Device, Body 1.6 x 0.8 mm; ComponentLink1URL: https://www.we-online.com/; PartNumber: 150060VS75000; RoHSCompliant: True; ComponentLink2URL: http://katalog.we-online.de/led/datasheet/150060VS75000.pdf; ComponentLink1Description: Manufacturer URL; Mounting Technology: Surface Mount; ComponentLink2Description: Datasheet
InputVoltage1 = HEADER_POS2_?44914-0201: GateName_1: G$1; SymbolName_1: HEADER_POS2; DeviceName: 44914-0201; LibraryName: con-molex-micro-fit-3_0_2; DeviceSetName: HEADER_POS2_?; Package: 44914-0201
R24 R27 R29 = 0402WGF1200TCE: ±1% 1/16W ±100ppm/℃ 120Ω 0402 Chip Resistor - Surface Mount ROHS; Manufacturer: UNI-ROYAL; Assembled: yes; Manufacturer Part Number: 0402WGF1200TCE; Distributor: JLCPCB; Price: $0.0015; JLCPCB Part Number: C25079
R25 R30 = CMP-1012-00623-3: Chip Resistor, 10 KOhm, +/- 1%, 0.1 W, -55 to 155 degC, 0603 (1608 Metric), RoHS, Tape and Reel; Manufacturer: Panasonic; Voltage Rating: 75V; Case\/Package: 0603; Power Rating: 100mW; Resistance: 10KOhm; Temperature Coefficient: 100ppm\/degreesC; Number of Pins: 2; Package Reference: 603; Depth: 0.8mm; Mount: SurfaceMount; Package Description: 2-Pin Surface Mount Device, Body 1.6 x 0.85 mm; Datasheet Version: 02/2017; Length: 1.6mm; Lead Free: LeadFree; Height: 0.45mm; Number of Terminations: 2; Max Power Dissipation: 100mW; Min Operating Temperature: -55degC; Datasheet URL: https://industrial.panasonic.com/cdbs/www-data/pdf/RDA0000/AOA0000C304.pdf; Termination: SMD/SMT; Case Code (Metric): 1608; Case Code (Imperial): 0603; Tolerance: 1%; Max Operating Temperature: 155degC; RoHSCompliant: true; Voltage Rating (DC): 75V; Radiation Hardening: No; Packaging: TapeandReel; Composition: ThickFilm; Mounting Technology: SurfaceMount; Manufacturer URL: http://www.panasonic.com/; Width: 0.031inch; REACH SVHC: NoSVHC; Contact Plating: Tin; Military Standard: Not; Package Quantity: 1
R26 R28 = 0402WGF4701TCE: 1/16W ±1% 4.7kΩ ±100ppm/℃ 0402 Chip Resistor - Surface Mount ROHS; Manufacturer: UNI-ROYAL; Assembled: yes; Manufacturer Part Number: 0402WGF4701TCE; Distributor: JLCPCB; Price: $0.0015; JLCPCB Part Number: C25900
R31 = 0402WGF1002TCE: 1/16W ±1% ±100ppm/℃ 10kΩ 0402 Chip Resistor - Surface Mount ROHS; Manufacturer: UNI-ROYAL; Assembled: yes; Manufacturer Part Number: 0402WGF1002TCE; Distributor: JLCPCB; Price: $0.0012; JLCPCB Part Number: C25744
RLED1 = CMP-1426-00011-1: SMD mono-color Chip LED, WL-SMCW, Red; Manufacturer: Wuerth Elektronik; Color: Red; PartNumber: 150080RS75000; PackageReference: 0805_A; ComponentLink2Description: Datasheet; ComponentLink1URL: http://www.we-online.com; ComponentLink1Description: Manufacturer URL; ComponentLink2URL: http://katalog.we-online.com/led/datasheet/150080RS75000.pdf
SCL1 SDA1 = CMP-2000-05181-1: as INTVCC1 on sheet 3.3V_Converter; Datasheet URL: https://ciiva.com/datasheet-click-2917627?src=ciiva&sig=bd195616; Mounting Type: 0.040"(1.02mm)HoleDiameter; Family: TestPoints; RoHS Information: RoHSComplianceStatement; Datasheet Version: Rev. G, 12/2008; Color: Black; Category: TestandMeasurement; Standard Package: 100; Manufacturer URL: http://www.keyelco.com/; Material: Base,Nylon46,UL94V-0; Type: PCTestPoint,Miniature; Terminal: 0.010"x0.020"(0.25mmx0.51mm)PhosphorBronzeWire,SilverPlated; Series: THM; Packaging: Bulk
U4 = CMP-12105-000052-1: IC MCU 32BIT 128KB FLASH 48LQFP; Manufacturer: STMicroelectronics; Manufacturer Part Number: STM32G071CBT6; Max Junction Temp: +105°C; Number Of I2C Channels: 2; Number Of Adc Channels: 17; Frequency: 64MHz; Memory Size: 128KBytes; Interface: I2C,SPI,UART,USART,USB,LIN,IrDA,I2S,Other; Ram Size: 36KBytes; Min Supply Voltage: 1.55V; Number Of Cores: 1; Max Supply Voltage: 3.6V; Core Architecture: ARM Cortex-M0+; Standoff Height: 0.05mm; Number Of Timers/Counters: 12; Number Of I/Os: 44; Data Bus Width: 32bits; Number Of Uart Channels: 5; Temperature Range Low: -40°C; Package: LQFP48-5B; Lead Free: Yes; Temperature Range High: +85°C; Octopart: https://octopart.com/stm32g071cbt6-stmicroelectronics-96627027; Ambient Temperature Range Low: -40°C; Automotive: No; Device Class L1: Integrated Circuits (ICs); Height: 1.6mm; ComponentLink2URL: https://www.st.com/resource/en/datasheet/stm32g071cb.pdf; Number Of Usb Channels: 2; Device Class L3: Microcontrollers; ComponentLink2Description: Datasheet; Number Of Spi Channels: 2; Memory Type: FLASH; Device Class L2: Embedded Processors and Controllers; Digikey Description: IC MCU 32BIT 128KB FLASH 48LQFP; Ambient Temperature Range High: +85°C; Category: IC; Number Of A/D Converters: 1; RoHS: TRUE; Temperature: -40°C to +85°C

## Sheet MCU_Power.SchDoc
size A; SheetNumber: 7; SheetTotal: 8
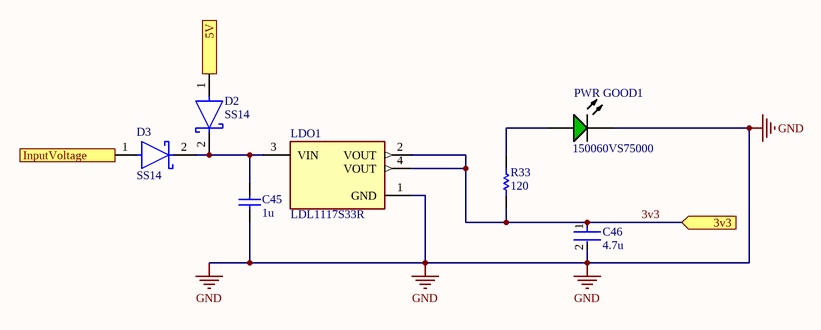
[diagram p3: MCU_Power.SchDoc]

### Parts
C45  1u  [CAPC3216X110X50LL20T25]
C46  4.7u  [FP-GRM188-0_2-IPC_C]
D2  SS14  [FP-403AE-MFG]
D3  SS14  [FP-403AE-MFG]
LDO1  LDL1117S33R  [FP-SOT223-0046067-IPC_C]
PWR_GOOD1  150060VS75000  [WE-150060VS75000_V]
R33  120  [RESC1608X55X30LL15T15]

### Ports
3v3 (in), 5V (in), InputVoltage (in)

### Nets
3v3: C46.1 LDO1.2(VOUT) LDO1.4(VOUT) R33.1 ; port 3v3
GND: C45.1 C46.2 LDO1.1(GND) PWR_GOOD1.1(K)
5V: D2.1(A) ; port 5V
NetC45_2: C45.2 D2.2(C) D3.2(C) LDO1.3(VIN)
NetD3_1: D3.1(A) ; port InputVoltage
NetPWR_GOOD1_2: PWR_GOOD1.2(A) R33.2

### Library data of the parts
C45 = CMP-2000-06011-1: Chip Capacitor, 1 uF, +/- 10%, 50 V, -55 to 125 degC, 1206 (3216 Metric), RoHS, Tape and Reel; Manufacturer: Kemet; Case Height: 1mm; Dielectric: X7R; Voltage Rating: 50V; Capacitance: 1uF; Temperature Coefficient / Code: +/-15%; Case Length: 3.2mm; Case Width: 1.6mm; Type: SMDMLCCX7R6.3-250VDCCommericalGrade; Class: Class1; Capacitance - nF: 1000nF; Datasheet URL: http://www.kemet.com/docfinder?Partnumber=C1206C105K5RACTU; Product Category: MultilayerCeramicCapacitorsMLCC-SMD/SMT; Termination Style: SMD/SMT; Dimensions: 1.6mmWx3.2mmLx1mmH; Voltage Rating DC: 50V; Datasheet Version: 02/2016; Packaging: Reel; Brand: Kemet; RoHS: Details; Minimum Operating Temperature: -55C; Operating Temperature Range: -55Cto+125C; Package Reference: 1206; Manufacturer URL: http://www.kemet.com/; Product: GeneralTypeMLCCs; Tolerance: 10%; Package Description: 2-Pin Surface Mount Device, Body 3.2 x 1.6 mm; Mounting Technology: SurfaceMount; Case Code - mm: 3216; Maximum Operating Temperature: +125C; Series: C1206C; Factory Pack Quantity: 2500; Package / Case: 1206(3216metric); Case Code - in: 1206
C46 = CMP-2006-02545-2: Chip Multilayer Ceramic Capacitors for General Purpose, 0603, 4.7uF, X5R, 15%, 10%, 35V; Lead Free: Lead Free; Max Operating Temperature: 85°C; Case Code (Imperial): 0603; Capacitance: 4.7uF; Width: 0.8mm; Thickness: 0.031inch; Case Code (Metric): 1608; Min Operating Temperature: -55°C; Voltage Rating (DC): 35V; Dielectric: X5R; Voltage: 35V; Packaging: Tape and Reel; Resistor Type: Ceramic; Weight: 0.000222oz; Mount: Surface Mount; Material: Ceramic; Depth: 0.8mm; Tolerance: 10%; REACH SVHC: No SVHC; Case/Package: 0603; Voltage Rating: 35V; Package Quantity: 4000; Height: 0.8mm; Length: 1.6mm; Termination: SMD/SMT
D2 D3 = CMP-2000-04943-2: DIODE SCHOTTKY 40V 1A SMA; Manufacturer: ON Semiconductor; Peak Reverse Current: 0.2mA; Max Junction Temp: +125°C; Standoff Height: 0.05mm; Max Surge Forward Current: 40A; Assembled: yes; Mouser Description: Schottky Diodes & Rectifiers SMA 40V 1.0A; RoHS: TRUE; Lead Free: Yes; Manufacturer Part Number: SS14; Device Class L3: Schottky Diodes; Category: Diode; Automotive: No; Digikey Description: DIODE SCHOTTKY 40V 1A SMA; ComponentLink2Description: Datasheet; Device Class L2: Diodes; Height: 2.5mm; Temperature Range High: +125°C; ComponentLink2URL: https://www.onsemi.com/pub/Collateral/SS19-D.PDF; Device Class L1: Discrete Semiconductors; Package: 403AE; Octopart: https://octopart.com/ss14-on+semiconductor-29205033; Max Repetitive Reverse Voltage: 40V; Temperature Range Low: -65°C; Forward Current: 1A; Temperature: -65°C to +125°C; Distributor: JLCPCB; JLCPCB Part Number: C2480
LDO1 = CMP-12153-000006-1: IC REG LINEAR 3.3V 1.2A SOT223; Manufacturer: STMicroelectronics; Output Type: Fixed; Min Supply Voltage: 2.6V; Number Of Outputs: 1; Dropout Voltage: 350mV; Output Current: 2A; Nominal Supply Current: 250uA; Standoff Height: 0.02mm; Max Supply Voltage: 18V; Max Junction Temp: +125°C; Accuracy Percentage: 2%; Automotive: No; Device Class L2: Power Management ICs; Height: 1.9mm; Octopart: https://octopart.com/ldl1117s33r-stmicroelectronics-81876163; Output Voltage: 3.3V; Package: SOT223-0046067; Lead Free: Yes; Temperature Range Low: -40°C; Category: IC; Device Class L1: Integrated Circuits (ICs); Ipc Land Pattern Name: SOT230P700X190-4; Mouser Description: LDL1117 Series 1.2 A 3.3 V High PSRR LDO Linear Voltage Regulator-SOT-223; ComponentLink2Description: Datasheet; ComponentLink2URL: https://www.st.com/resource/en/datasheet/ldl1117.pdf; Device Class L3: Voltage Regulators - Linear; Manufacturer Part Number: LDL1117S33R; Temperature Range High: +125°C; Digikey Description: IC REG LINEAR 3.3V 1.2A SOT223; Temperature: -40°C to +125°C; RoHS: TRUE
PWR_GOOD1 = CMP-1426-00006-4: as GLED1 on sheet Custom_MCU; DatasheetVersion: Rev. 2.7; PackageDescription: 2-Pin Surface Mount Device, Body 1.6 x 0.8 mm; ComponentLink1URL: https://www.we-online.com/; PartNumber: 150060VS75000; RoHSCompliant: True; ComponentLink2URL: http://katalog.we-online.de/led/datasheet/150060VS75000.pdf; ComponentLink1Description: Manufacturer URL; Mounting Technology: Surface Mount; ComponentLink2Description: Datasheet
R33 = CMP-2000-00713-1: Manufacturer: Panasonic; Part Number: ERJ-3GEYJ121V

## Sheet MCU_Connectors.SchDoc
size A; SheetNumber: 8; SheetTotal: 8
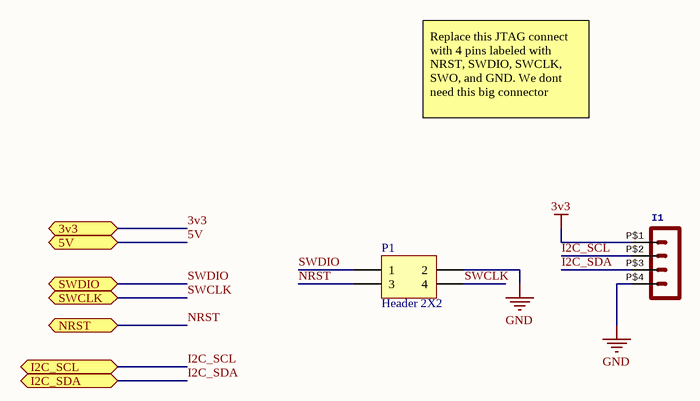
[diagram p4: MCU_Connectors.SchDoc]

### Parts
I1  Molex - Micro-Fit 3.0 Series connector,  3.00mm (0.118") pitch header, 4 positions.  [44914-0401]  (value not drawn)
P1  Header 2X2  [HDR2X2]

### Ports
3v3 (bidir), 5V (bidir), I2C_SCL (bidir), I2C_SDA (bidir), NRST (bidir), SWCLK (bidir), SWDIO (bidir)

### Nets
3v3: I1.P$1 ; port 3v3
GND: I1.P$4 P1.2
I2C_SCL: I1.P$2 ; port I2C_SCL
I2C_SDA: I1.P$3 ; port I2C_SDA
NRST: P1.3 ; port NRST
SWCLK: P1.4 ; port SWCLK
SWDIO: P1.1 ; port SWDIO

### Notes on the sheet
- Replace this JTAG connect with 4 pins labeled with NRST, SWDIO, SWCLK, SWO, and GND. We dont need this big connector

### Library data of the parts
I1 = HEADER_POS4_?44914-0401: GateName_1: G$1; SymbolName_1: HEADER_POS4; DeviceName: 44914-0401; LibraryName: con-molex-micro-fit-3_0_2; DeviceSetName: HEADER_POS4_?; Package: 44914-0401
P1 = Header 2X2: Header, 2-Pin, Dual row; LatestRevisionDate: 17-Jul-2002; LatestRevisionNote: Re-released for DXP Platform.; Publisher: Altium Limited

## Nets that join several sheets
3v3: Custom_MCU (12 pins), MCU_Power (C46.1 LDO1.2 LDO1.4 R33.1), MCU_Connectors (I1.P$1)
GND: PDB_Custom_MCU (85 pins), 3.3V_Converter (25 pins), Custom_MCU (10 pins), MCU_Power (C45.1 C46.2 LDO1.1 PWR_GOOD1.1), MCU_Connectors (I1.P$4 P1.2)
5V: PDB_Custom_MCU (33 pins), MCU_Power (D2.1)
I2C_SCL: Custom_MCU (R25.2 U4.45), MCU_Connectors (I1.P$2)
I2C_SDA: Custom_MCU (R30.2 U4.32), MCU_Connectors (I1.P$3)
NetCS1_1: PDB_Custom_MCU (CS1.1 CS1.2), 3.3V_Converter (F2.2)
NetD1_1: PDB_Custom_MCU (D1.1 J1.2 R1.1), 3.3V_Converter (F1.2)
NetD3_1: Custom_MCU (InputVoltage1.P$1), MCU_Power (D3.1)
NRST: Custom_MCU (C41.2 R31.2 U4.10), MCU_Connectors (P1.3)
SCL: PDB_Custom_MCU (Temp1.2 Temp2.2 Temp3.2), Custom_MCU (R26.1 SCL1.1 U4.22)
SDA: PDB_Custom_MCU (Temp1.1 Temp2.1 Temp3.1), Custom_MCU (R28.1 SDA1.1 U4.23)
SWCLK: Custom_MCU (U4.36), MCU_Connectors (P1.4)
SWDIO: Custom_MCU (U4.35), MCU_Connectors (P1.1)